# Altium schematic sheet LT6813.SchDoc
size A3; SheetNumber: 5; SheetTotal: 5
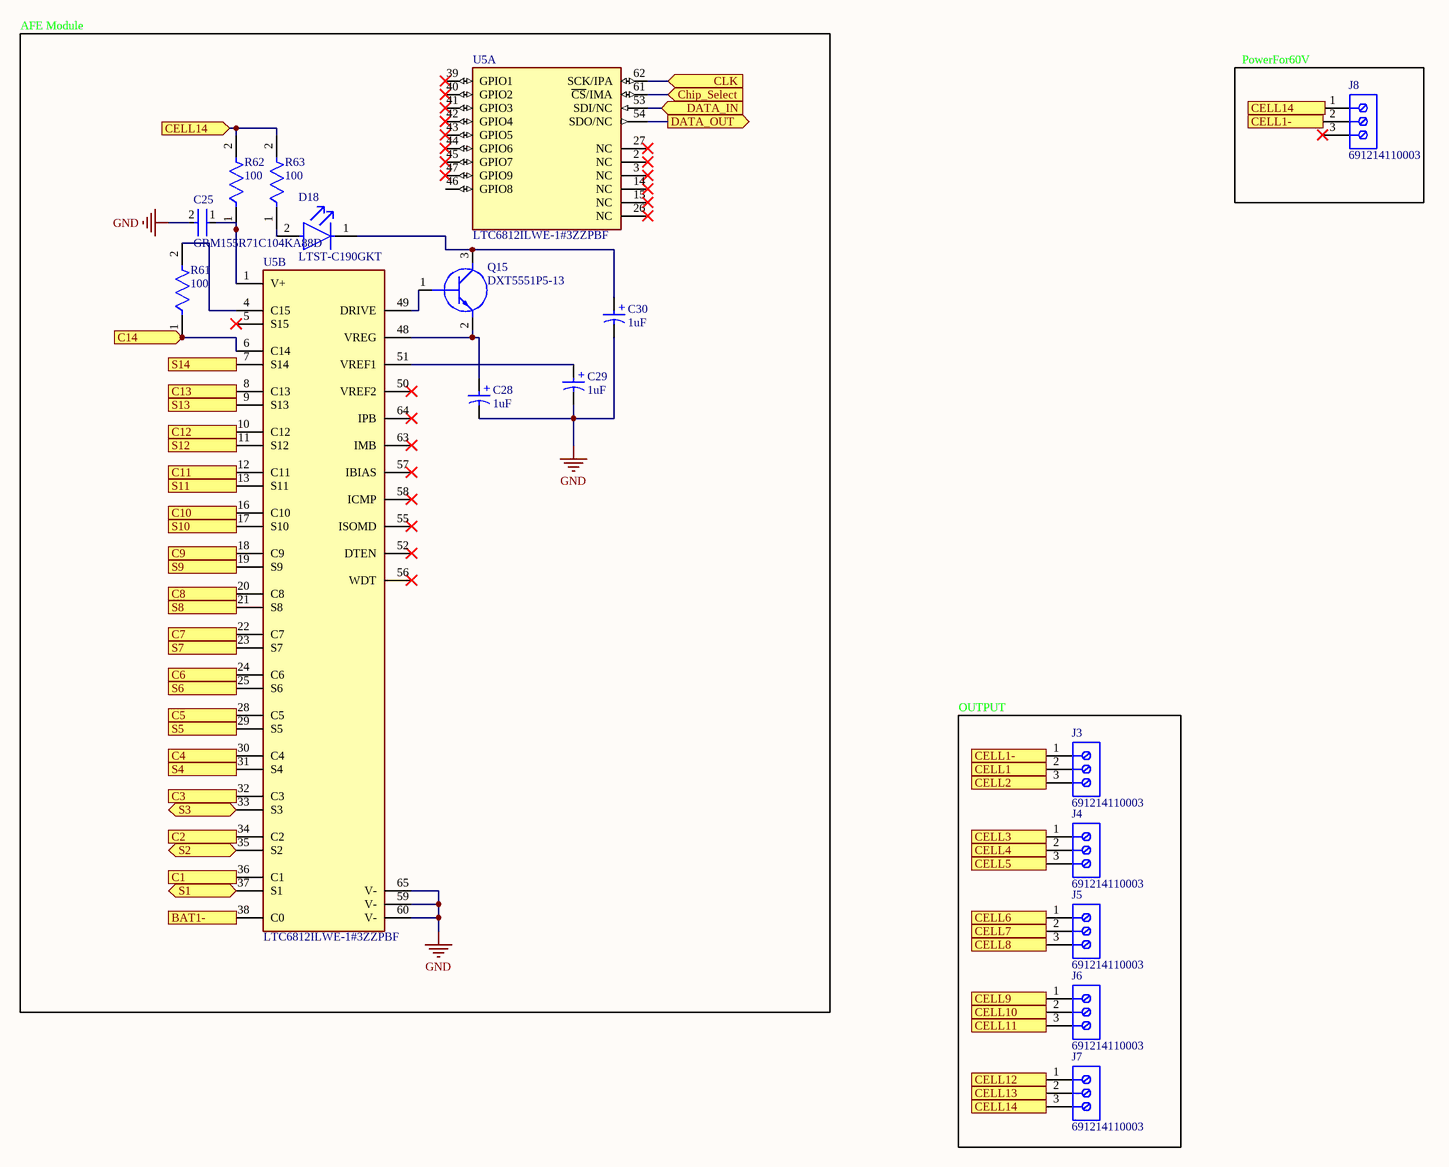
[diagram p0: LT6813.SchDoc]

## Parts
C25  GRM155R71C104KA88D  [FP-GRM15-MFG]
C28  1uF  [WCAP-ASLI_D4H5.5]
C29  1uF  [WCAP-ASLI_D4H5.5]
C30  1uF  [WCAP-ASLI_D4H5.5]
D18  LTST-C190GKT  [FP-LTST-C190GKT-MFG]
J3  691214110003  [691214110003]
J4  691214110003  [691214110003]
J5  691214110003  [691214110003]
J6  691214110003  [691214110003]
J7  691214110003  [691214110003]
J8  691214110003  [691214110003]
Q15  DXT5551P5-13  [DXT5551P513]
R61  100  [FP-RR0816-MFG]
R62  100  [FP-RR0816-MFG]
R63  100  [FP-RR0816-MFG]
U5  LTC6812ILWE-1#3ZZPBF  [FP-LWE-64-05-08-1982-MFG]  (parts A,B of 2)

## Blocks framed on the sheet
AFE Module: C25 C28-C30 D18 Q15 R61-R63 U5
PowerFor60V: J8
OUTPUT: J3-J7

## Ports
BAT1- (in), C1 (in), C2 (in), C3 (out), C4 (in), C5 (in), C6 (in), C7 (in), C8 (in), C9 (in), C10 (in), C11 (in), C12 (in), C13 (in), C14 (in), CELL1 (in), CELL1- (in), CELL2 (in), CELL3 (in), CELL4 (in), CELL5 (in), CELL6 (in), CELL7 (in), CELL8 (in), CELL9 (in), CELL10 (in), CELL11 (in), CELL12 (in), CELL13 (in), CELL14, CELL14 (in), Chip_Select (in), CLK (in), DATA_IN (in), DATA_OUT (out), S1 (bidir), S2 (bidir), S3 (bidir), S4 (in), S5 (in), S6 (in), S7 (in), S8 (in), S9 (in), S10 (in), S11 (in), S12 (in), S13 (in), S14 (in)

## Nets
GND: C25.2 C28.2(N) C29.2(N) C30.2(N) U5.59(V-) U5.60(V-) U5.65(V-)
BAT1-: U5.38(C0) ; port BAT1-
C1: U5.36(C1) ; port C1
C2: U5.34(C2) ; port C2
C3: U5.32(C3) ; port C3
C4: U5.30(C4) ; port C4
C5: U5.28(C5) ; port C5
C6: U5.24(C6) ; port C6
C7: U5.22(C7) ; port C7
C8: U5.20(C8) ; port C8
C9: U5.18(C9) ; port C9
C10: U5.16(C10) ; port C10
C11: U5.12(C11) ; port C11
C12: U5.10(C12) ; port C12
C13: U5.8(C13) ; port C13
C14: R61.1 U5.6(C14) ; port C14
CELL1: J3.2 ; port CELL1
CELL1-: J3.1 J8.2 ; port CELL1-
CELL2: J3.3 ; port CELL2
CELL3: J4.1 ; port CELL3
CELL4: J4.2 ; port CELL4
CELL5: J4.3 ; port CELL5
CELL6: J5.1 ; port CELL6
CELL7: J5.2 ; port CELL7
CELL8: J5.3 ; port CELL8
CELL9: J6.1 ; port CELL9
CELL10: J6.2 ; port CELL10
CELL11: J6.3 ; port CELL11
CELL12: J7.1 ; port CELL12
CELL13: J7.2 ; port CELL13
CELL14: J7.3 R62.2 R63.2 ; port CELL14
Chip_Select: U5.61(~{CS}/IMA) ; port Chip_Select
CLK: U5.62(SCK/IPA) ; port CLK
DATA_IN: U5.53(SDI/NC) ; port DATA_IN
DATA_OUT: U5.54(SDO/NC) ; port DATA_OUT
S1: U5.37(S1) ; port S1
S2: U5.35(S2) ; port S2
S3: U5.33(S3) ; port S3
S4: U5.31(S4) ; port S4
S5: U5.29(S5) ; port S5
S6: U5.25(S6) ; port S6
S7: U5.23(S7) ; port S7
S8: U5.21(S8) ; port S8
S9: U5.19(S9) ; port S9
S10: U5.17(S10) ; port S10
S11: U5.13(S11) ; port S11
S12: U5.11(S12) ; port S12
S13: U5.9(S13) ; port S13
S14: U5.7(S14) ; port S14
NetC25_1: C25.1 R62.1 U5.1(V+)
NetC28_1: C28.1(P) Q15.2(E) U5.48(VREG)
NetC29_1: C29.1(P) U5.51(VREF1)
NetC30_1: C30.1(P) D18.1(C) Q15.3(C)
NetD18_2: D18.2(A) R63.1
NetQ15_1: Q15.1(B) U5.49(DRIVE)
NetR61_2: R61.2 U5.4(C15)

Not connected (* = marked no-connect by the designer): J8 1 3*; U5 2(NC)* 3(NC)* 5(S15)* 14(NC)* 15(NC)* 26(NC)* 27(NC)* 39(GPIO1)* 40(GPIO2)* 41(GPIO3)* 42(GPIO4)* 43(GPIO5)* 44(GPIO6)* 45(GPIO7)* 46(GPIO8) 47(GPIO9)* 50(VREF2)* 52(DTEN)* 55(ISOMD)* 56(WDT)* 57(IBIAS)* 58(ICMP)* 63(IMB)* 64(IPB)*

## Notes on the sheet
- (in symbol CMP-03913-130590197-1) +

## Library data of the parts
C25 = CMP-2100-03641-2: CAP CER 0.1UF 16V X7R 0402; Manufacturer: Murata; Standoff Height: 0mm; Tolerance: 10%; Voltage Rating: 16Vdc; Material: Ceramic; Capacitance: 0.10μF; Value: 0.10μF; RoHS: TRUE; Manufacturer Part Number: GRM155R71C104KA88D; Temperature Characteristic: X7R; Octopart: https://octopart.com/grm155r71c104ka88d-murata-196880; Digikey Description: CAP CER 0.1UF 16V X7R 0402; Device Class L3: Ceramic Capacitors; Height: 0.55mm; ComponentLink2Description: Datasheet; Temperature Range Low: -55°C; Ipc Land Pattern Name: CAPC10050X219; ComponentLink2URL: https://search.murata.co.jp/Ceramy/image/img/A01X/G101/ENG/GRM155R71H471KA01-01A.pdf; Device Class L1: Passive Components; Lead Free: yes; Category: Cap; Package: GRM15; Temperature: -55°C to +125°C; Device Class L2: Capacitors; Temperature Range High: +125°C; Mouser Description: 0402 0.1 uF 16V ±10 % Tolerance X7R SMT Multilayer Ceramic Capacitor
C28-C30 = CMP-03913-130590197-1: 865080840001 Cap, 1Uf, 20%, 100V, Alu Elec Smd Rohs Compliant: Yes; Insulation Resistance: 33.3333MΩ; Capacitance: 1µF; Impedance: 20.381Ω; Leakage Current: 3µA; Ripple Current: 7mA; Width: 4.3mm; Min Operating Temperature: -55°C; NexarPartId: 130590197; RoHS: Compliant; Length: 5.5mm; Voltage Rating: 100V; Max Operating Temperature: 105°C; Diameter: 4mm
D18 = CMP-22017-000005-2: LED GREEN CLEAR CHIP SMD; Dominant Wavelength: 569nm; Reverse Voltage: 5V; Lens Color: Colorless; Viewing Angle: 130°; Voltage: 2V; Forward Current: 30mA; Power Dissipation: 100mW; Luminous Intensity: 6mcd; Number of LEDs: 1; Forward Voltage: 2.1V; Wavelength: 565nm; Test Current: 10mA; Min Operating Temperature: -55°C; Lens Style: Clear; Mount: Surface Mount; Width: 0.8mm; Packaging: Tape and Reel; Lens Transparency: Clear; Case Code (Metric): 1608; Depth: 0.8mm; Case Code (Imperial): 0603; Case/Package: 0603; Number of Pins: 2; Max Operating Temperature: 85°C; Lead Free: Lead Free; Number of Elements: 1; Length: 1.6mm; Height: 0.8mm; Package Quantity: 1; Power Rating: 100mW; Radiation Hardening: No; Illumination Color: Green; Color: Green
J3-J8 = CMP-1502-02466-2: NexarPartId: 18818289; Number of Levels: 1; Voltage: 300V; Pitch: 3.5052mm; Stripping Length: -6mm; Number of Positions Per Level: 3; Plating: Brass, Steel; Wire/Cable Gauge: 24AWG; Wire Gauge (Min): 16AWG; Current Rating: 10A; Width: 10.9mm; Length: 7.4mm; Housing Material: Nylon; Height: 12.2mm; Min Operating Temperature: -40°C; Contact Plating: Brass, Tin; Packaging: Box; Color: Blue, Green; Number of Contacts: 3; Number of Pins: 3; Voltage Rating: 300V; Termination: Screw; Lead Pitch: 3.5mm; Max Operating Temperature: 105°C; Mount: Through Hole; Contact Material: Brass; RoHS: Compliant; Wire Gauge (Max): 24AWG; Current: 10A; REACH SVHC: Unknown
Q15 = DXT5551P5-13: Transistor BJT NPN; Manufacturer_Name: Diodes Incorporated; Datasheet Link: https://www.diodes.com//assets/Datasheets/DXT5551P5.pdf; Height: 1.15mm; Manufacturer_Part_Number: DXT5551P5-13; Mouser Part Number: 522-DXT5551P5-13; Mouser Price/Stock: https://www.mouser.co.uk/ProductDetail/Diodes-Incorporated/DXT5551P5-13?qs=pmB%252BthhaMeURGx362MbdPw%3D%3D; Arrow Part Number: DXT5551P5-13; Arrow Price/Stock: https://www.arrow.com/en/products/dxt5551p5-13/diodes-incorporated?region=europe
R61-R63 = CMP-2000-02416-2: 100Ω ±0.5% 0.0625W 1/16W Chip Resistor 0603 (1608 Metric) Thin Film; Voltage Rating: 75V; Power Rating: 63mW; Resistance: 100R; Temperature Coefficient: 25ppm/°C; Number of Terminations: 2; Resistance Tolerance: 0.5%; Termination: SMD/SMT; Tolerance: 0.5%; Case/Package: 0603; Series: RR; Min Operating Temperature: -55°C; Case Code (Imperial): 0603; Number of Pins: 2; Packaging: Cut Tape; Width: 0.031inch; Resistor Type: Thin Film; RoHS Compliant: Yes; Lead Free: Lead Free; Depth: 0.8mm; Technology: THIN FILM; Size Code: 0603; Voltage Rating (DC): 75V; Package Quantity: 1; Case Code (Metric): 1608; Length: 1.6mm; Height: 0.4mm; Max Operating Temperature: 125°C; Weight: 7.1E-05oz; Max Power Dissipation: 63mW
U5 = CMP-09132-000006-1: MULTICELL BAT MON S; Manufacturer: Analog Devices; Nominal Supply Current: 3-6.1uA; Number Of Outputs: 9; Max Junction Temp: +150°C; Min Supply Voltage: 16V; Standoff Height: 0.05mm; Number Of Cells: 15; Automotive Grade: Grade 3; Max Supply Voltage: 75V; Temperature: -40°C to +85°C; Height: 1.6mm; Manufacturer Part Number: LTC6812ILWE-1#3ZZPBF; Category: IC; ComponentLink2Description: Datasheet; Digikey Description: MULTICELL BAT MON S; Device Class L1: Integrated Circuits (ICs); Temperature Range High: +85°C; Octopart: https://octopart.com/ltc6812ilwe-1%233zzpbf-analog+devices-97359568; Temperature Range Low: -40°C; Device Class L2: Power Management ICs; Package: LWE-64-05-08-1982; ComponentLink2URL: https://www.analog.com/media/en/technical-documentation/data-sheets/LTC6812-1.pdf; RoHS: TRUE; Ipc Land Pattern Name: QFP50P1200X1200X160-64; Lead Free: Yes; Automotive: Yes; Device Class L3: Battery Management